# Altium project 温湿度光照传感.PrjPcb
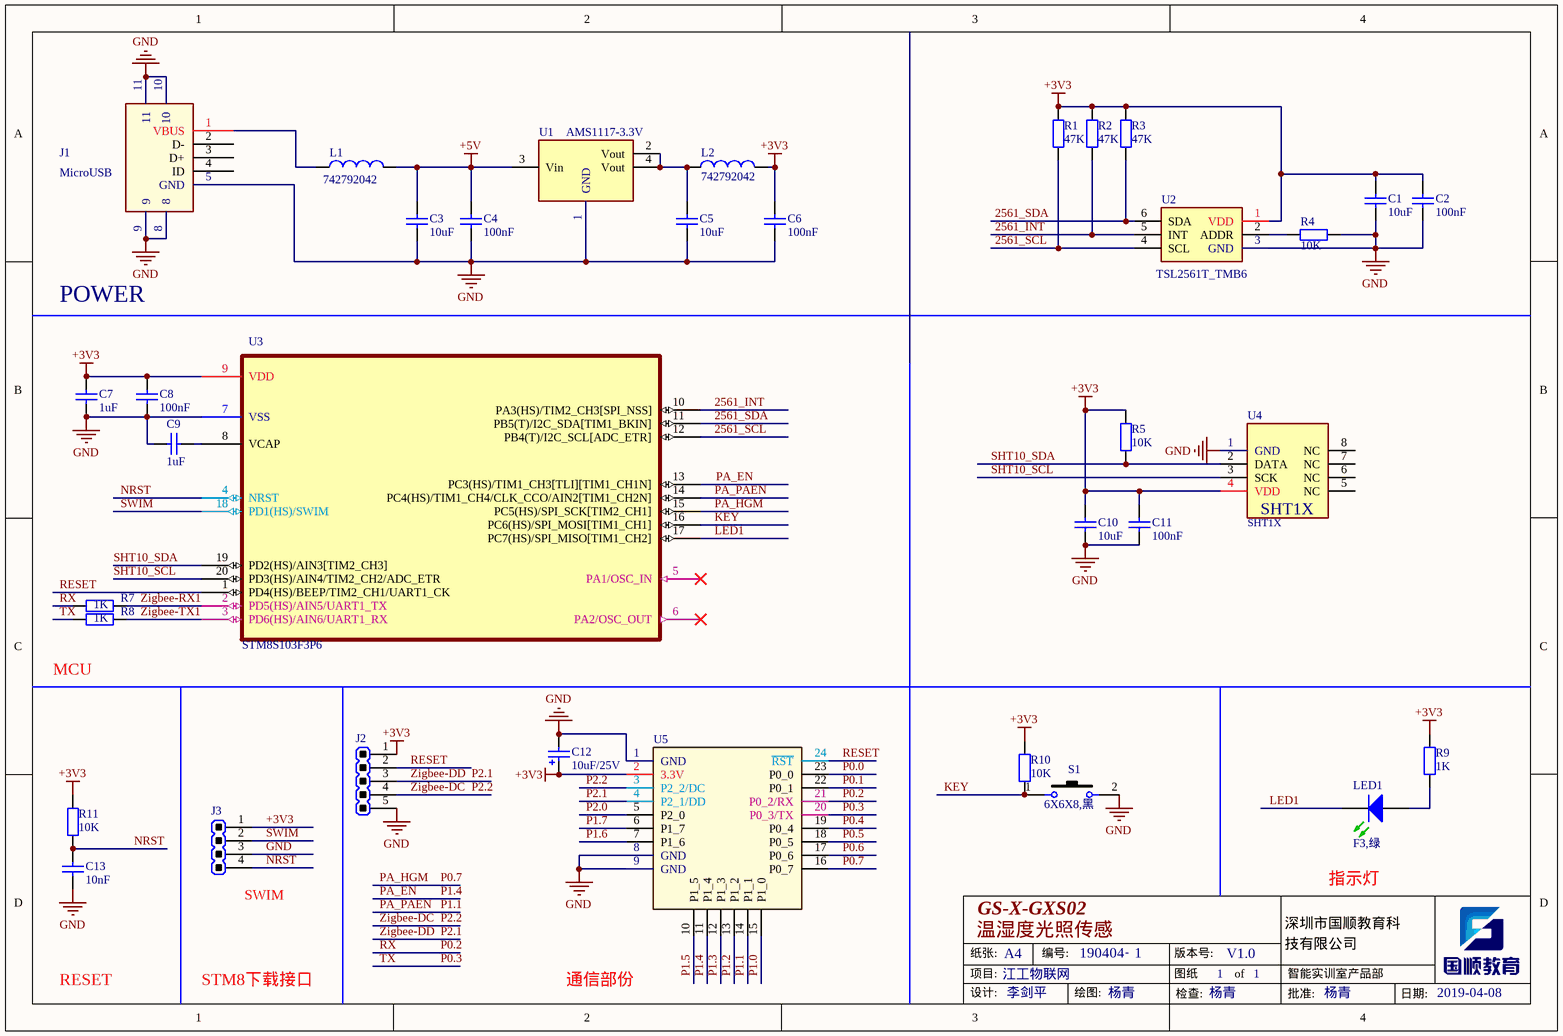
[diagram p0: 温湿度光照传感.SchDoc]
1 sheet, 35 parts. Net scope: global (net labels, ports and power ports of the same name join across sheets).
Board file: 温湿度光照传感.PcbDoc

## Sheet 温湿度光照传感.SchDoc: 温湿度光照传感
size A4; Organization: 智能实训室产品部; Address1: 广东省深圳市; Address2: 宝安区石岩凯普达工业园; DocumentNumber: 190404; Revision: V1.0; SheetNumber: 1; SheetTotal: 1; Date: 2019-04-08; ApprovedBy: 杨青; CheckedBy: 杨青; DrawnBy: 杨青; Engineer: 李剑平; ProjectName_GTA: 江工物联网; PCB Number: GS-X-GXS02

### Parts
C1  10uF  [C0603]
C2  100nF  [C0603]
C3  10uF  [C0603]
C4  100nF  [C0603]
C5  10uF  [C0603]
C6  100nF  [C0603]
C7  1uF  [C0603]
C8  100nF  [C0603]
C9  1uF  [C0603]
C10  10uF  [C0603]
C11  100nF  [C0603]
C12  10uF/25V  [TC3528X21B]
C13  10nF  [C0603]
J1  MicroUSB  [USB-F-Micro5P]
J2  HDRM-2.54/11-1*5P-AK  [HDRM-2.54-1*5P-AK]  (value not drawn)  (no BOM)
J3  HDRM-2.54/11-1*4P-AK  [HDRM-2.54-1*4P-AK]  (value not drawn)  (no BOM)
L1  742792042  [L0805]
L2  742792042  [L0805]
LED1  F3,绿  [LED-F3-G-H]
R1  47K  [R0603]
R2  47K  [R0603]
R3  47K  [R0603]
R4  10K  [R0603]
R5  10K  [R0603]
R7  1K  [R0603]
R8  1K  [R0603]
R9  1K  [R0603]
R10  10K  [R0603]
R11  10K  [R0603]
S1  6X6X8,黑  [SW-6.0X6.0X8.0-STAND-BK]
U1  AMS1117-3.3V  [SOT-223]
U2  TSL2561T_TMB6  [TSL2561T]
U3  STM8S103F3P6  [TSSOP20-0.65/4.4]
U4  SHT1X  [SHT1X]
U5  ZigBee_Z-0003  [Module_ZigBee_Z-0003]  (value not drawn)  (no BOM)

### Nets
+3V3: C1.1 C2.1 C6.1 C7.1 C8.2 C10.1 C11.1 C12.1 J2.1 J3.1 L2.2 R1.2 R2.2 R3.2 R5.2 R9.1 R10.2 R11.2 U2.1(VDD) U3.9(VDD) U4.4(VDD) U5.2(3.3V)
+5V: C3.1 C4.1 L1.2 U1.3(Vin)
GND: C1.2 C2.2 C3.2 C4.2 C5.2 C6.2 C7.2 C8.1 C9.2 C10.2 C11.2 C12.2 C13.1 J1.5(GND) J1.8 J1.9 J1.10 J1.11 J2.5 J3.3 R4.1 S1.2 U1.1(GND) U2.3(GND) U3.7(VSS) U4.1(GND) U5.1(GND) U5.8(GND) U5.9(GND)
2561_INT: R2.1 U2.5(INT) U3.10(PA3(HS)/TIM2_CH3[SPI_NSS])
2561_SCL: R1.1 U2.4(SCL) U3.12(PB4(T)/I2C_SCL[ADC_ETR])
2561_SDA: R3.1 U2.6(SDA) U3.11(PB5(T)/I2C_SDA[TIM1_BKIN])
KEY: R10.1 S1.1 U3.16(PC6(HS)/SPI_MOSI[TIM1_CH1])
LED1: LED1.2(K) U3.17(PC7(HS)/SPI_MISO[TIM1_CH2])
NRST: C13.2 J3.4 R11.1 U3.4(NRST)
P0.0: U5.23(P0_0)
P0.1: U5.22(P0_1)
P0.2: R7.1 U5.21(P0_2/RX)  [also labelled RX]
P0.3: R8.1 U5.20(P0_3/TX)  [also labelled TX]
P0.4: U5.19(P0_4)
P0.5: U5.18(P0_5)
P0.6: U5.17(P0_6)
P0.7: U3.15(PC5(HS)/SPI_SCK[TIM2_CH1]) U5.16(P0_7)  [also labelled PA_HGM]
P1.0: U5.15(P1_0)
P1.1: U3.14(PC4(HS)/TIM1_CH4/CLK_CCO/AIN2[TIM1_CH2N]) U5.14(P1_1)  [also labelled PA_PAEN]
P1.2: U5.13(P1_2)
P1.3: U5.12(P1_3)
P1.4: U3.13(PC3(HS)/TIM1_CH3[TLI][TIM1_CH1N]) U5.11(P1_4)  [also labelled PA_EN]
P1.5: U5.10(P1_5)
P1.6: U5.7(P1_6)
P1.7: U5.6(P1_7)
P2.0: U5.5(P2_0)
P2.1: J2.3 U5.4(P2_1/DD)  [also labelled Zigbee-DD]
P2.2: J2.4 U5.3(P2_2/DC)  [also labelled Zigbee-DC]
RESET: J2.2 U3.1(PD4(HS)/BEEP/TIM2_CH1/UART1_CK) U5.24(~{RST})
SHT10_SCL: U3.20(PD3(HS)/AIN4/TIM2_CH2/ADC_ETR) U4.3(SCK)
SHT10_SDA: R5.1 U3.19(PD2(HS)/AIN3[TIM2_CH3]) U4.2(DATA)
SWIM: J3.2 U3.18(PD1(HS)/SWIM)
Zigbee-RX1: R7.2 U3.2(PD5(HS)/AIN5/UART1_TX)
Zigbee-TX1: R8.2 U3.3(PD6(HS)/AIN6/UART1_RX)
NetC5_1: C5.1 L2.1 U1.2(Vout) U1.4(Vout)
NetC9_1: C9.1 U3.8(VCAP)
NetJ1_1: J1.1(VBUS) L1.1
NetLED1_1: LED1.1(A) R9.2
NetR4_2: R4.2 U2.2(ADDR)

Not connected (* = marked no-connect by the designer): J1 2(D-) 3(D+) 4(ID); U3 5(PA1/OSC_IN)* 6(PA2/OSC_OUT)*; U4 5(NC) 6(NC) 7(NC) 8(NC)

### Notes on the sheet
- POWER
- MCU
- (near J3) SWIM
- 指示灯
- RESET
- STM8下载接口
- 通信部份
- 纸张:
- 项目:
- A4
- 编号:
- -
- 版本号:
- 图纸
- of
- 深圳市国顺教育科
- 技有限公司
- 设计:
- 绘图:
- 检查:
- 批准:
- 日期:

### Library data of the parts
C1 C3 C5 C10 = 10uF_16V_0603: Capacitor; 编码: 无; 规格/型号: 10uF,16V,0603; 物料名称: 贴片电容
C2 C4 C6 C8 C11 = 100nF_50V_0603: Capacitor; 编码: 无; 规格/型号: 100nF,50V,0603; 物料名称: 贴片电容
C7 C9 = 1uF_25V_X7R_0603: Capacitor; 编码: 无; 规格/型号: 1uF,25V,X7R,0603; 物料名称: 贴片电容
C12 = CAPC-10uF/25V_3528B: 钽电容,10uF/25V-3528B; 编码: 1010202012; 物料名称: 贴片钽电容; 规格/型号: 钽电容,10uF,25V,3528,B型
C13 = 10nF_16V_0603: Capacitor; 编码: 无; 规格/型号: 10nF,16V,0603; 物料名称: 贴片电容
J1 = USB-F-Miro5P: MicroUSB 母座; 规格/型号: 全铜 Micro 5P,四脚插 7.2,有柱,长针有卷边,母座,贴片; 物料名称: USB接口; 供应商: https://item.taobao.com/item.htm?spm=a1z09.2.0.0.5260b1d2CTc69y&id=538106330041&_u=165bp1a58c2
J2 = HDRM-2.54/11-1*5P-AK: 排针,直; 规格/型号: 排针,间距2.54,针长11mm,1*5P,180°直插; 物料名称: 排针
J3 = HDRM-2.54/11-1*4P-AK: 排针,直; 规格/型号: 排针,间距2.54,针长11mm,1*4P,180°直插; 物料名称: 排针
L1 L2 = BEAD-742792042_0805: WE-CBF,600@100M,500Ohm,200mA,0805,742792042; 品牌: WE; 物料名称: 贴片磁珠; 规格/型号: WE-CBF,磁珠,600@100M，500Ohm,200mA,0805,742792042; 单价: 0.04
LED1 = LED-绿_F3: F3,圆头,绿发绿; 编码: 1010303004; 物料名称: 直插发光二极管; 规格/型号: F3,圆头,绿发绿
R1-R3 = 47K_5%_0603: 47K,±5%,0603; 物料名称: 贴片电阻; 单价: 0.02; 规格/型号: 47K,±5%,0603; 参数: ±5%
R4 R5 R10 R11 = 10K_5%_0603: 10K,±5%,0603; 物料名称: 贴片电阻; 单价: 0.02; 规格/型号: 10K,±5%,0603; 参数: ±5%
R7-R9 = 1K_5%_0603: 1K,±5%,0603; 编码: 1010101190; 物料名称: 贴片电阻; 单价: 0.02; 规格/型号: 1K,±5%,0603; 参数: ±5%
S1 = SW-PB_6X6X8-STAND-BK: 6X6X8,黑,插针,支架; 规格/型号: 轻触开关,6*6*8,4PIN,黑色,插针,卧式带支架; 物料名称: 卧式带支架; 供应商: https://item.taobao.com/item.htm?spm=2013.1.0.0.5bd8580cuxGiNk&id=41163712780
U1 = AMS1117-3.3V_SOT223: 三端稳压器; 编码: 1010402018; 规格/型号: AMS1117-3.3,SOT-223; 物料名称: 贴片稳压芯片; 单价: 0.18
U2 = TSL2561T_TMB6: 光照传感器; 物料名称: 贴片芯片; 编码: 1010501198; 规格/型号: TSL2561T,T6
U3 = STM8S103F3P6_TSSOP20: STM8 ARM-based 32-bit MCU with 8 Kbytes Flash, 20-pin TSSOP, Industrial Temperature; 物料名称: 贴片芯片; 规格/型号: STM8S103F3P6,TSSOP20
U4 = SHT1X: 温湿度传感器; 编码: 1012001004; 规格/型号: SHT11,贴片; 品牌: SENSIRION; 供应商: 无; 物料名称: 温湿度传感器
U5 = Module_ZigBee_Z-0003_1: zigbee模块接口